# EAGLE design powerdist-hw (EAGLE 7.3.0)
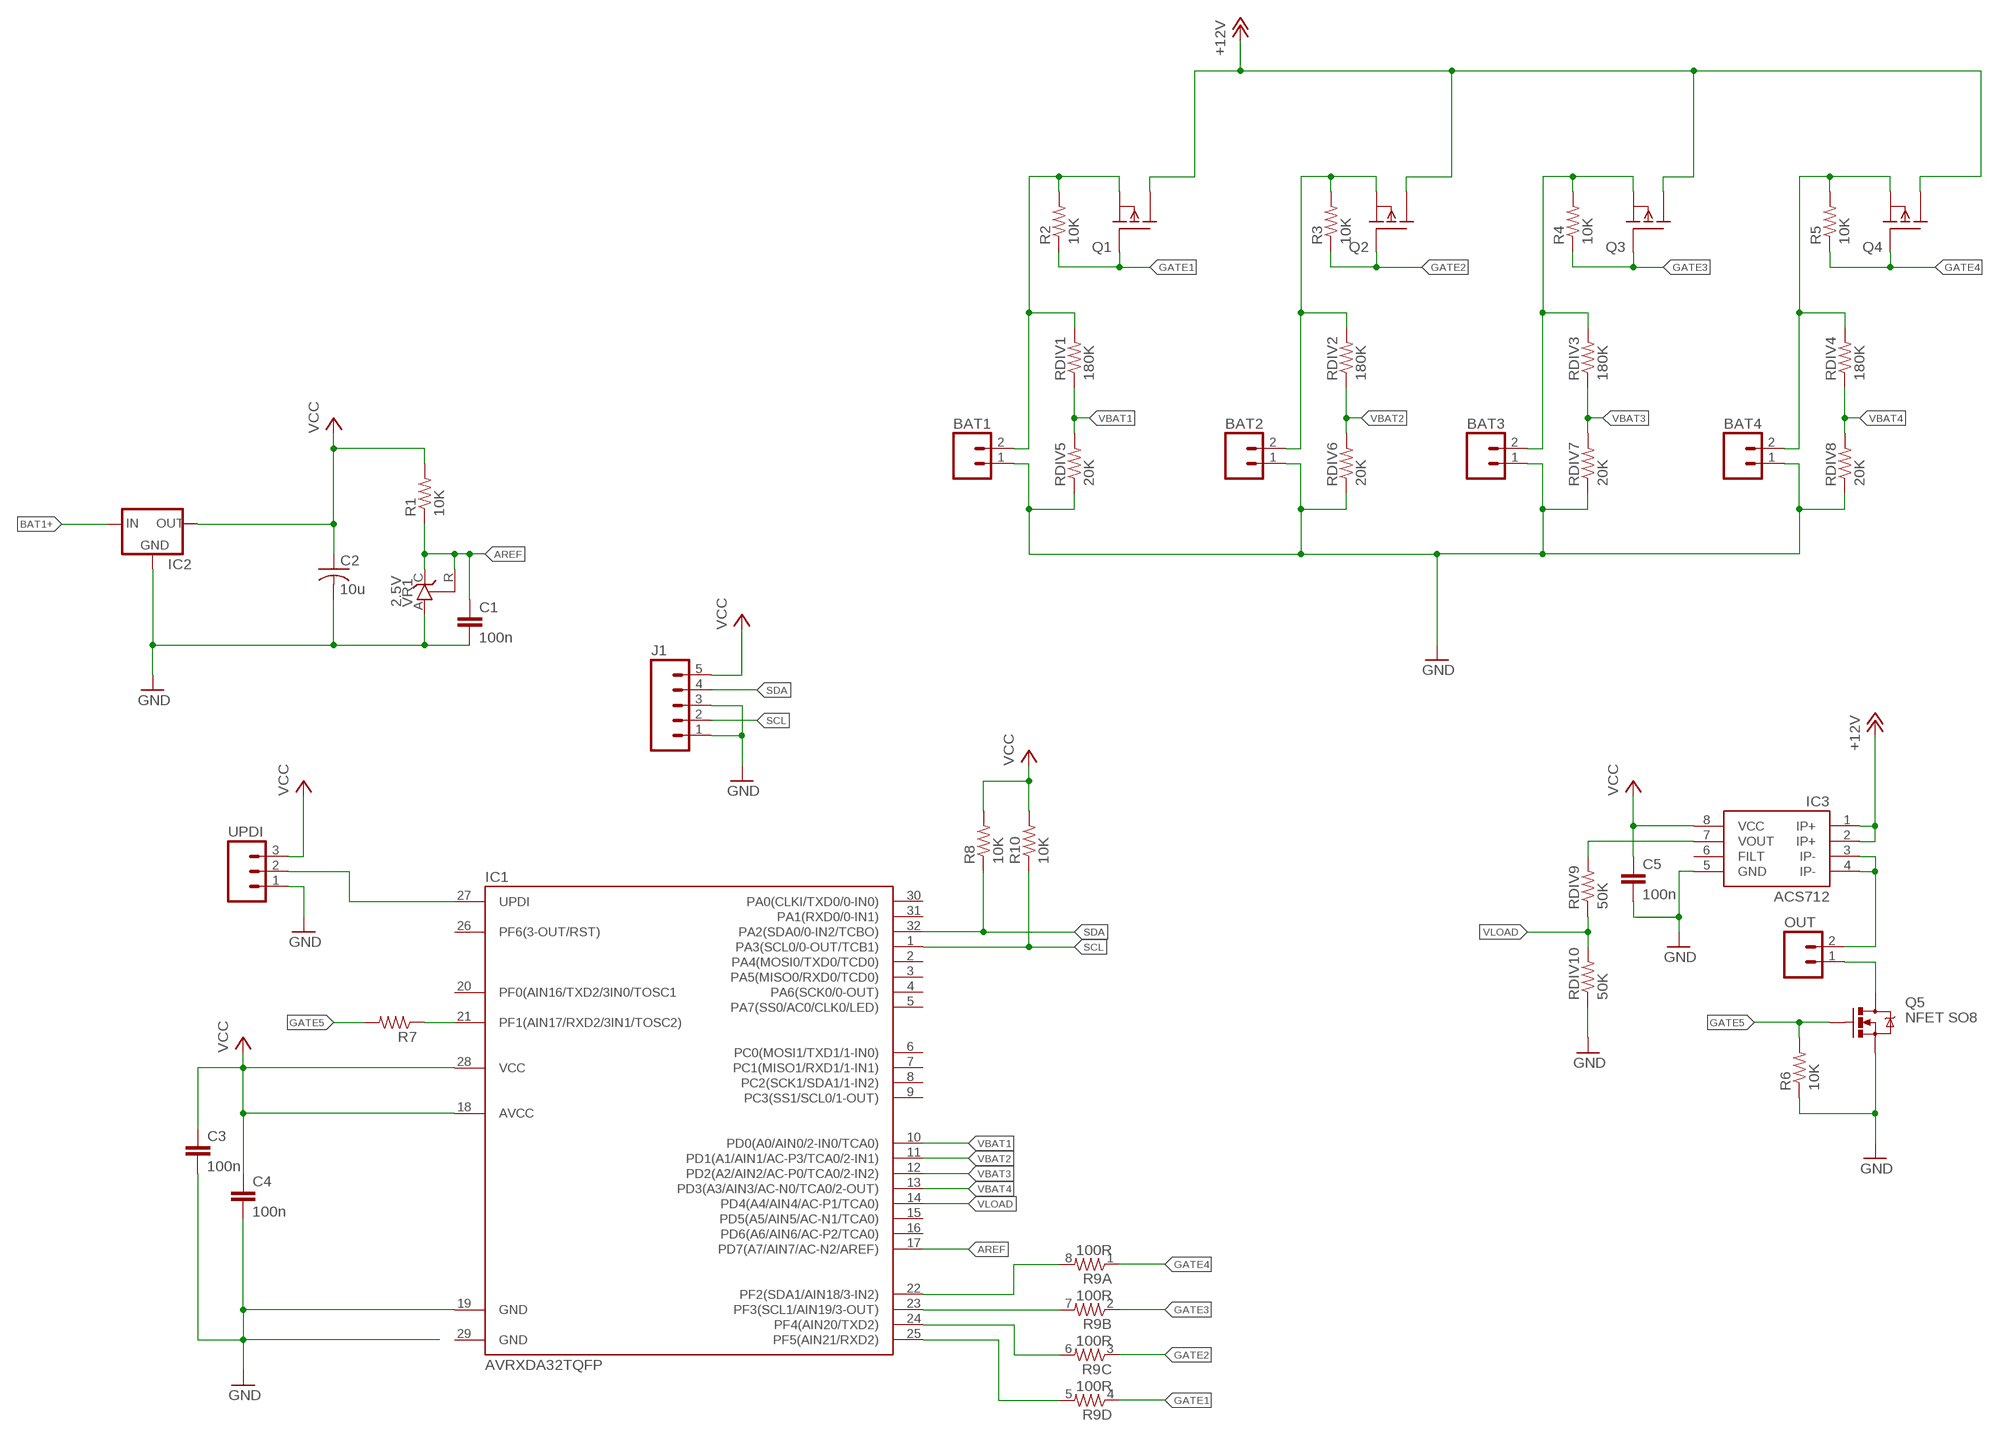
[diagram p0: schematic, sheet 1]

## Parts
BAT1  M02LOCK_LONGPADS  [1X02_LOCK_LONGPADS]
BAT2  M02LOCK_LONGPADS  [1X02_LOCK_LONGPADS]
BAT3  M02LOCK_LONGPADS  [1X02_LOCK_LONGPADS]
BAT4  M02LOCK_LONGPADS  [1X02_LOCK_LONGPADS]
C1  100n  C-EUC0603  [C0603]
C2  10u  C-USC0805  [C0805]
C3  100n  C-EUC0603  [C0603]
C4  100n  C-EUC0603  [C0603]
C5  100n  C-EUC0603  [C0603]
IC1  AVRXDA32TQFP  [TQFP32-08]
IC2  78XXS  [78XXS]
IC3  ACS712  [SO08]
J1  M05JST  [JST-5-PTH]
OUT  M02LOCK_LONGPADS  [1X02_LOCK_LONGPADS]
Q1  PFETSO8  [SO-08]
Q2  PFETSO8  [SO-08]
Q3  PFETSO8  [SO-08]
Q4  PFETSO8  [SO-08]
Q5  NFET SO8  MOSFET-NCHANNELFDS6630A  [SO08]
R1  10K  R-US_R0603  [R0603]
R2  10K  R-US_R0603  [R0603]
R3  10K  R-US_R0603  [R0603]
R4  10K  R-US_R0603  [R0603]
R5  10K  R-US_R0603  [R0603]
R6  10K  R-US_R0603  [R0603]
R7  R-US_R0603  [R0603]
R8  10K  R-US_R0603  [R0603]
R9  100R  RESISTOR-ARRAY0603-ARV  [0603-ARV]
R10  10K  R-US_R0603  [R0603]
RDIV1  180K  RESISTOR0805-RES  [0805]
RDIV2  180K  RESISTOR0805-RES  [0805]
RDIV3  180K  RESISTOR0805-RES  [0805]
RDIV4  180K  RESISTOR0805-RES  [0805]
RDIV5  20K  RESISTOR0805-RES  [0805]
RDIV6  20K  RESISTOR0805-RES  [0805]
RDIV7  20K  RESISTOR0805-RES  [0805]
RDIV8  20K  RESISTOR0805-RES  [0805]
RDIV9  50K  RESISTOR0805-RES  [0805]
RDIV10  50K  RESISTOR0805-RES  [0805]
UPDI  M03PTH  [1X03]
VR1  2.5V  TL431CLP  [TO92-CLP]

## Nets
+12V: IC3.1(IP+) IC3.2(IP+) Q1.5(D) Q1.6(D) Q1.7(D) Q1.8(D) Q2.5(D) Q2.6(D) Q2.7(D) Q2.8(D) Q3.5(D) Q3.6(D) Q3.7(D) Q3.8(D) Q4.5(D) Q4.6(D) Q4.7(D) Q4.8(D)
AREF: C1.1 IC1.17(PD7(A7/AIN7/AC-N2/AREF)) R1.1 VR1.C VR1.R
BAT1+: BAT1.2 IC2.IN Q1.1(S) Q1.2(S) Q1.3(S) R2.2 RDIV1.2
BAT2+: BAT2.2 Q2.1(S) Q2.2(S) Q2.3(S) R3.2 RDIV2.2
BAT3+: BAT3.2 Q3.1(S) Q3.2(S) Q3.3(S) R4.2 RDIV3.2
BAT4+: BAT4.2 Q4.1(S) Q4.2(S) Q4.3(S) R5.2 RDIV4.2
GATE1: Q1.4(G) R2.1 R9.4
GATE1`: IC1.25(PF5(AIN21/RXD2)) R9.5
GATE2: Q2.4(G) R3.1 R9.3
GATE3: Q3.4(G) R4.1 R9.2
GATE4: Q4.4(G) R5.1 R9.1
GATE5: Q5.4(G) R6.2 R7.2
GATE5`: IC1.21(PF1(AIN17/RXD2/3IN1/TOSC2)) R7.1
GND: BAT1.1 BAT2.1 BAT3.1 BAT4.1 C1.2 C2.2 C3.2 C4.2 C5.2 IC1.19(GND) IC2.GND IC3.5(GND) J1.1 J1.3 Q5.1(S) Q5.2(S) Q5.3(S) R6.1 RDIV5.1 RDIV6.1 RDIV7.1 RDIV8.1 RDIV10.1 UPDI.1 VR1.A
N$1: IC3.7(VOUT) RDIV9.2
N$2: IC1.27(UPDI) UPDI.2
N$3: IC1.22(PF2(SDA1/AIN18/3-IN2)) R9.8
N$4: IC1.23(PF3(SCL1/AIN19/3-OUT)) R9.7
N$5: IC1.24(PF4(AIN20/TXD2)) R9.6
OUT+: IC3.3(IP-) IC3.4(IP-) OUT.2
OUT-: OUT.1 Q5.5(D) Q5.6(D) Q5.7(D) Q5.8(D)
SCL: IC1.1(PA3(SCL0/0-OUT/TCB1)) J1.2 R10.1
SDA: IC1.32(PA2(SDA0/0-IN2/TCBO)) J1.4 R8.1
VBAT1: IC1.10(PD0(A0/AIN0/2-IN0/TCA0)) RDIV1.1 RDIV5.2
VBAT2: IC1.11(PD1(A1/AIN1/AC-P3/TCA0/2-IN1)) RDIV2.1 RDIV6.2
VBAT3: IC1.12(PD2(A2/AIN2/AC-P0/TCA0/2-IN2)) RDIV3.1 RDIV7.2
VBAT4: IC1.13(PD3(A3/AIN3/AC-N0/TCA0/2-OUT)) RDIV4.1 RDIV8.2
VCC: C2.1 C3.1 C4.1 C5.1 IC1.18(AVCC) IC1.28(VCC) IC2.OUT IC3.8(VCC) J1.5 R1.2 R8.2 R10.2 UPDI.3
VLOAD: IC1.14(PD4(A4/AIN4/AC-P1/TCA0)) RDIV9.1 RDIV10.2
Unconnected: IC1.2(PA4(MOSI0/TXD0/TCD0)) IC1.3(PA5(MISO0/RXD0/TCD0)) IC1.4(PA6(SCK0/0-OUT)) IC1.5(PA7(SS0/AC0/CLK0/LED)) IC1.6(PC0(MOSI1/TXD1/1-IN0)) IC1.7(PC1(MISO1/RXD1/1-IN1)) IC1.8(PC2(SCK1/SDA1/1-IN2)) IC1.9(PC3(SS1/SCL0/1-OUT)) IC1.15(PD5(A5/AIN5/AC-N1/TCA0)) IC1.16(PD6(A6/AIN6/AC-P2/TCA0)) IC1.20(PF0(AIN16/TXD2/3IN0/TOSC1) IC1.26(PF6(3-OUT/RST)) IC1.30(PA0(CLKI/TXD0/0-IN0)) IC1.31(PA1(RXD0/0-IN1)) IC3.6(FILT)

## Power pins joined to a net without a drawn wire
GND: IC1.29(GND)

## Library data of the parts
BAT1-BAT4 OUT = SparkFun-Connectors:M02: Standard 2-pin 0.1" header. Use with - straight break away headers ( PRT-00116) - right angle break away headers (PRT-00553) - swiss pins (PRT-00743) - machine pins (PRT-00117) - female headers (PRT-00115) Molex polarized connector foot print use with: PRT-08233 with associated crimp pins and housings. 2.54_SCREWTERM for use with PRT-10571. 3.5mm Screw Terminal footprints for PRT-08084 5mm Screw Terminal footprints for use with PRT-08432
C1 C3-C5 = rcl:C-EU: CAPACITOR, European symbol
C2 = rcl:C-US: CAPACITOR, American symbol
IC1 = microchip-special:AVRXDA32: The AVR128DA28/32/48/64 microcontrollers of the AVR® DA family are using the AVR CPU with hardware multiplier, running at up to 24 MHz, with 128 KB of Flash, 16 KB of SRAM, and 512B of EEPROM in 28-, 32-, 48- or 64-pin packages. The AVR® DA family uses the latest technologies from Microchip Technology, with a flexible and low-power architecture including Event System, intelligent analog features, advanced digital peripherals and Peripheral Touch Controller (PTC).
IC2 = v-reg:78XXS: VOLTAGE REGULATOR
IC3 = SparkFun-AnalogIC:ACS712: Hall-effect-based isolated linear current sensor; PROD_ID: IC-08964
J1 = SparkFun-Connectors:M05: Header 5 Standard 5-pin 0.1" header. Use with straight break away headers (SKU : PRT-00116), right angle break away headers (PRT-00553), swiss pins (PRT-00743), machine pins (PRT-00117), and female headers (PRT-00115). Molex polarized connector foot print use with SKU : PRT-08230 with associated crimp pins and housings.
Q1-Q4 = transistor-generic:PFET
Q5 = SparkFun-DiscreteSemi:MOSFET-NCHANNEL: Common NMOSFET Parts MFG P/N Store ID Prod ID FDD8780 TRANS-09984 SI7820DN TRANS-11055 FDS6630A IC-08089 2N7002PW TRANS-11151 FQP30N06L COM-10213 TRANS-10060 BSS123LT1G TRANS-08345 BSS138 TRANS-00830 BS170 2N7000; PROD_ID: IC-08089
R1-R8 R10 = rcl:R-US_: RESISTOR, American symbol
R9 = SparkFun-Resistors:RESISTOR-ARRAY: Array Chip Resistor Source: RS Component / Phycomp
RDIV1-RDIV10 = SparkFun-Resistors:RESISTOR: Resistor Basic schematic elements and footprints for 0603, 1206, and PTH resistors.
UPDI = SparkFun-Connectors:M03: Header 3 Standard 3-pin 0.1" header. Use with straight break away headers (SKU : PRT-00116), right angle break away headers (PRT-00553), swiss pins (PRT-00743), machine pins (PRT-00117), and female headers (PRT-00115). Molex polarized connector foot print use with SKU : PRT-08232 with associated crimp pins and housings.
VR1 = vreg-special:TL431CLP: VOLTAGE REGULATOR

## Board
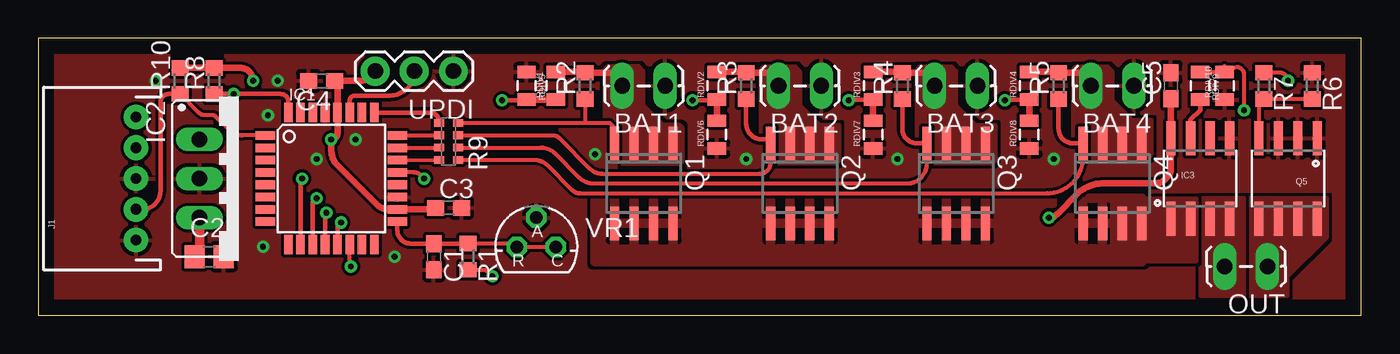
[diagram p1: board, top side]
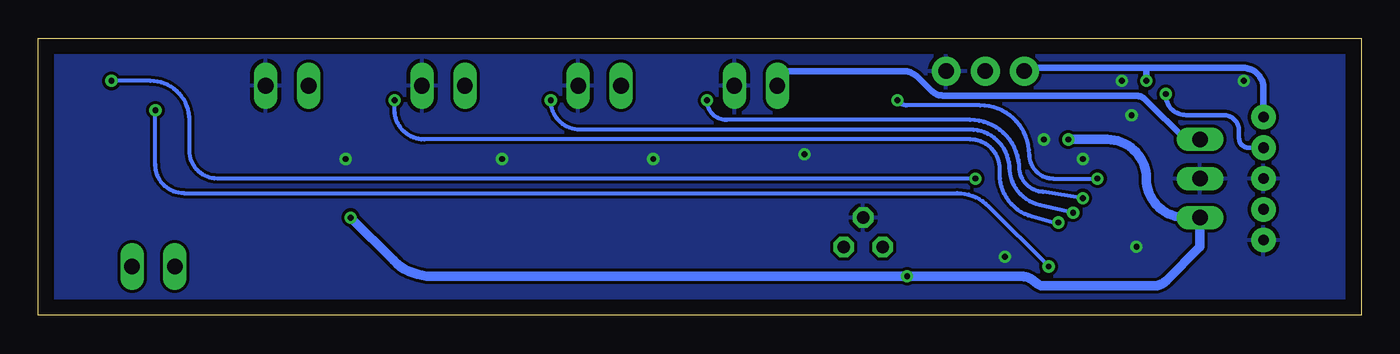
[diagram p2: board, bottom side, seen from below]

Size 86.03 x 18 mm. Coordinates in mm from the lower left corner, seen from the top.
Outline: 0,0 86.03,0 86.03,18 0,18 0,0
Copper layers (1*16): Top 0.035mm / dielectric 1.5mm / Bottom 0.035mm
Design rules "default": minimum track width 10mil, minimum drill 24mil, track to track 8mil, track to pad 8mil, pad to pad 8mil, via to via 8mil, smd to smd 8mil, copper to edge 40mil, drill to drill 8mil, minimum pad ring 10mil, minimum via ring 8mil, stop-mask expansion 4mil, vias tented up to drill 0mil, thermal gap 10mil

### Footprints (pad centres in the part's own frame; a part is rotated, then mirrored left to right if it is on the bottom)
1X02_LOCK_LONGPADS = drill 1.016 long: 1 -0.127,0; 2 2.667,0
C0603 = smd 1.1 x 1: 1 -0.85,0; 2 0.85,0
C0805 = smd 1.3 x 1.5: 1 -0.95,0; 2 0.95,0
TQFP32-08 = smd 1.27 x 0.559: 1 -4.293,2.8; 2 -4.293,2; 3 -4.293,1.2; 4 -4.293,0.4; 5 -4.293,-0.4; 6 -4.293,-1.2; 7 -4.293,-2; 8 -4.293,-2.8; 17 4.293,-2.8; 18 4.293,-2; 19 4.293,-1.2; 20 4.293,-0.4; 21 4.293,0.4; 22 4.293,1.2; 23 4.293,2; 24 4.293,2.8 | smd 0.559 x 1.27: 9 -2.8,-4.293; 10 -2,-4.293; 11 -1.2,-4.293; 12 -0.4,-4.293; 13 0.4,-4.293; 14 1.2,-4.293; 15 2,-4.293; 16 2.8,-4.293; 25 2.8,4.293; 26 2,4.293; 27 1.2,4.293; 28 0.4,4.293; 29 -0.4,4.293; 30 -1.2,4.293; 31 -2,4.293; 32 -2.8,4.293
78XXS = drill 1.016 long: GND 0,-2.54; IN -2.54,-2.54; OUT 2.54,-2.54
SO08 = smd 0.61 x 2.21: 1 -1.905,-2.616; 2 -0.635,-2.616; 3 0.635,-2.616; 4 1.905,-2.616; 5 1.905,2.616; 6 0.635,2.616; 7 -0.635,2.616; 8 -1.905,2.616
JST-5-PTH = drill 0.7 pad 1.6: 1 -4,0; 2 -2,0; 3 0,0; 4 2,0; 5 4,0
SO-08 = smd 0.6 x 2.2: 1 -1.905,-2.6; 2 -0.635,-2.6; 3 0.635,-2.6; 4 1.905,-2.6; 5 1.905,2.6; 6 0.635,2.6; 7 -0.635,2.6; 8 -1.905,2.6
R0603 = smd 1 x 1.1: 1 -0.85,0; 2 0.85,0
0603-ARV = smd 0.5 x 0.65: 1 -1.2,-0.625; 2 -0.4,-0.625; 3 0.4,-0.625; 4 1.2,-0.625; 5 1.2,0.625; 6 0.4,0.625; 7 -0.4,0.625; 8 -1.2,0.625
0805 = smd 0.8 x 1.2: 1 -0.9,0; 2 0.9,0
1X03 = drill 1.016 pad 1.88: 1 0,0; 2 2.54,0; 3 5.08,0
TO92-CLP = drill 0.813 octagon: A 0,1.905; C 1.27,0; R -1.27,0

### Placement (x,y rotation side)
BAT1  40.64,14.92 180 top
BAT2  50.8,14.92 180 top
BAT3  60.96,14.92 180 top
BAT4  71.12,14.92 180 top
C1  25.72,3.81 270 top
C2  11.11,3.81 0 top
C3  26.67,6.99 0 top
C4  18.41,15.24 180 top
C5  73.66,14.92 90 top
IC1  19.05,8.89 0 top
IC2  13.02,8.89 270 top
IC3  75.56,8.89 0 top
J1  6.35,8.89 90 top
OUT  79.82,3.17 180 top
Q1  39.37,8.57 180 top
Q2  49.53,8.57 180 top
Q3  59.69,8.57 180 top
Q4  69.85,8.57 180 top
Q5  81.28,8.89 180 top
R1  27.94,3.81 270 top
R2  35.56,14.92 90 top
R3  46.04,14.92 90 top
R4  56.2,14.92 90 top
R5  66.36,14.92 90 top
R6  82.87,14.92 270 top
R7  79.69,14.92 270 top
R8  11.43,15.24 90 top
R9  26.67,11.3 90 top
R10  9.21,15.24 90 top
RDIV1  33.66,14.92 90 top
RDIV2  44.13,14.92 90 top
RDIV3  54.29,14.92 90 top
RDIV4  64.45,14.92 90 top
RDIV5  31.75,14.92 270 top
RDIV6  44.13,11.75 90 top
RDIV7  54.29,11.75 90 top
RDIV8  64.45,11.75 90 top
RDIV9  75.56,14.92 270 top
RDIV10  77.15,14.92 90 top
UPDI  26.99,15.88 180 top
VR1  32.38,4.45 0 top

### Tracks (layer width: path | path; a pad name or v marks a point on that pad's centre or on a via)
+12V
  pour Top (rank 4): 36.2,7.62 71.75,7.62 71.75,3.49 36.2,3.49
  pour Top (rank 3, no thermals): 69.85,7.62 75.31,7.62 75.31,3.49 69.85,3.49
AREF
  Top 0.254: VR1.C VR1.R 31.11,4.66 R1.1
  Top 0.305: R1.1 C1.1 24.23,4.66 arc-90 23.34,5.55 IC1.17
BAT1+
  Top 0.406: 37.97,15.82 BAT1.2 37.97,15.77 R2.2 35.56,15.82 RDIV1.2
  Bottom 0.406: IC2.IN 11.43,11.43 13.99,13.99 arc-45 14.7,14.29 27.21,14.29 arc45 27.92,14.58 28.79,15.46 arc-45 29.8,15.88 37.97,15.88 BAT1.2
  pour Top (rank 4, no thermals): 39.05,16.19 37.15,16.19 arc90 36.83,15.88 36.83,10.16 arc90 37.15,9.84 41.59,9.84 arc90 41.91,10.16 41.91,12.06 arc90 41.59,12.38 40.64,12.38 39.37,13.65 39.37,15.88
BAT2+
  Top 0.406: RDIV2.2 46.04,15.82 R3.2 48.13,15.77 BAT2.2
  pour Top (rank 4, no thermals): 52.07,12.38 52.07,10.16 arc-90 51.75,9.84 47.31,9.84 arc-90 46.99,10.16 46.99,15.88 arc-90 47.31,16.19 49.21,16.19 49.53,15.88 49.53,13.65 50.8,12.38
BAT3+
  Top 0.406: RDIV3.2 56.2,15.82 R4.2 58.29,15.77 BAT3.2
  pour Top (rank 4, no thermals): 62.23,12.38 62.23,10.16 arc-90 61.91,9.84 57.47,9.84 arc-90 57.15,10.16 57.15,15.88 arc-90 57.47,16.19 59.37,16.19 59.69,15.88 59.69,13.65 60.96,12.38
BAT4+
  Top 0.406: RDIV4.2 66.36,15.82 R5.2 68.45,15.77 BAT4.2
  pour Top (rank 4, no thermals): 71.94,10.16 67.63,10.16 arc-90 67.31,10.48 67.31,15.88 arc-90 67.63,16.19 69.53,16.19 69.85,15.88 69.85,13.97 71.12,12.7 72.39,12.7 72.39,10.61 arc-90
GATE1
  Top 0.254: R9.4 35.56,12.5 | Q1.4 37.47,12.19 37.15,12.5 35.56,12.5 | R2.1 35.56,12.5
GATE1`
  Top 0.305: IC1.25 25.48,13.18 arc-90 26.04,12.63 R9.5
GATE2
  Top 0.254: R9.3 33.43,11.7 arc-45 33.89,11.51 35.86,9.54 arc45 36.67,9.21 46.91,9.21 arc90 47.62,9.92 Q2.4
  Top 0.305: 47.62,10.11 Q2.4 47.62,11.43 47.04,11.43 arc-90 46.04,12.43 R3.1
GATE3
  Top 0.254: R9.2 32.69,10.9 arc-45 33.61,10.52 35.18,8.96 arc45 36.1,8.57 56.52,8.57 arc90 57.78,9.84 Q3.4
  Top 0.305: Q3.4 57.15,11.17 arc-90 56.2,12.13 R4.1
GATE4
  Top 0.254: R9.1 32.25,10.1 arc-45 33.12,9.74 34.72,8.14 arc45 35.22,7.94 65.62,7.94 arc90 67.94,10.26
  Top 0.305: R5.1 66.36,12.13 arc90 67.31,11.17 Q4.4 67.94,10.26
GATE5
  Top 0.254: Q5.4 79.38,14.07 R7.2 R6.2
GATE5`  (via drill 0.38)
  Top 0.254: v25.08,8.89 24.99,9.01 arc52 24.4,9.29 IC1.21 | v81.28,15.24 arc90 80.75,15.77 R7.1
  Bottom 0.254: v25.08,8.89 74.4,8.89 arc90 76.2,10.69 76.2,12.7 arc-90 78.74,15.24 v81.28,15.24
GND  (via drill 0.38)
  other vias: 14.92,13.02 15.56,15.24 20.64,11.43 18.1,10.16 7.62,15.24 23.18,3.81 14.61,4.45 36.2,10.48 46.04,10.16 55.88,10.16 66.04,10.16
  pour Top (rank 6): 0,17.78 86.36,17.78 86.36,0 0,0
  pour Bottom (rank 6): 86.36,17.78 0,17.78 0,0 86.36,0
N$1
  Top 0.305: RDIV9.2 75.56,13.34 74.93,12.7 IC3.7
N$2
  Top 0.305: IC1.27 20.25,13.96 arc-90 20.57,14.29 22.86,14.29 arc90 UPDI.2
N$3
  Top 0.254: IC1.22 R9.8
N$4
  Top 0.254: IC1.23 R9.7
N$5
  Top 0.254: IC1.24 R9.6
OUT+
  pour Top (rank 4, no thermals): 75.56,7.62 75.56,1.27 78.42,1.27 78.42,7.62
OUT-
  pour Top (rank 5, no thermals): 78.74,7.62 78.74,1.27 81.28,1.27 81.28,2.54 83.82,5.08 83.82,7.62
SCL
  Top 0.254: IC1.1 13.27,11.69 arc-45 12.39,12.05 11.52,12.93 arc45 11.3,13.02 10.8,13.02 arc-45 10.43,13.17 R10.1
  Top 0.305: J1.2 6.74,6.89 arc90 7.94,8.09 7.94,13.86 arc-90 8.46,14.39 R10.1
SDA  (via drill 0.38)
  Top 0.305: 16.25,13.02 IC1.32 16.25,13.9 arc90 15.76,14.39 13.97,14.39 v12.7,14.39 R8.1
  Bottom 0.305: J1.4 7.31,10.89 arc90 7.94,11.52 7.94,12.01 arc-90 8.94,13.02 11.39,13.02 arc90 12.7,14.33 v12.7,14.39
VBAT1  (via drill 0.38)
  Top 0.305: RDIV5.2 31.75,13.97 v30.16,13.97 | v17.14,8.89 arc90 17.05,8.79 IC1.10
  Top 0.406: RDIV5.2 RDIV1.1
  Bottom 0.254: v17.14,8.89 20.02,8.89 arc90 21.59,10.46 arc-90 24.78,13.65 29.55,13.65 arc45 30.05,13.86 v30.16,13.97
VBAT2  (via drill 0.38)
  Top 0.305: 17.78,4.6 IC1.11 17.85,7.37 arc-90 v18.1,7.62 | v42.55,13.97 44.13,13.97 RDIV2.1
  Top 0.406: RDIV6.2 RDIV2.1
  Bottom 0.254: v18.1,7.62 20.67,8.02 arc81 22.23,9.51 arc-90 25.42,12.7 41.27,12.7 arc90 v42.55,13.97
VBAT3  (via drill 0.38)
  Top 0.305: v52.7,13.97 52.7,14.02 RDIV3.1 | IC1.12 18.65,6.67 v18.73,6.67
  Top 0.406: RDIV3.1 RDIV7.2
  Bottom 0.254: v18.73,6.67 20.89,7.17 arc77 22.86,9.64 22.86,9.51 arc-90 25.42,12.06 50.8,12.06 arc90 v52.7,13.97
VBAT4  (via drill 0.38)
  Top 0.305: IC1.13 19.45,5.8 arc-90 v19.68,6.03 | v62.87,13.97 62.87,14.02 RDIV4.1
  Top 0.406: RDIV8.2 RDIV4.1
  Bottom 0.254: v19.68,6.03 20,6.03 21.39,6.41 arc75 23.5,9.17 23.5,9.5 arc-90 25.43,11.43 60.93,11.43 arc90 62.87,13.36 v62.87,13.97
VCC  (via drill 0.38)
  Top 0.254: IC1.18 23.34,6.99 | R1.2 28.93,2.96 arc-45 29.23,2.83 v29.53,2.54
  Top 0.406: C5.1 IC3.8 73.66,9.5 arc-45 73.45,9 73.3,8.85 arc-45 72.63,8.57 69.18,8.57 arc45 67.61,7.92 66.27,6.58 arc-45 v65.72,6.35 | 19.45,15.24 IC1.28 19.45,11.83 arc-90 v19.05,11.43 19.05,10.69 arc45 19.42,9.79 22.02,7.19 arc45 22.75,6.89 IC1.18 25.73,6.89 C3.1 | 19.45,15.24 C4.1 | R10.2 R8.2 13.12,16.09 arc-90 v13.97,15.24 | 19.45,15.24 20.88,15.24 arc45 21.55,15.52 UPDI.3
  Top 0.61: C2.1 10.48,3.81 IC2.OUT
  Bottom 0.406: J1.5 6.35,14.75 arc-90 7.69,16.09 13.97,16.09 | v13.97,15.24 13.97,16.09 | 13.97,16.09 21.69,16.09 UPDI.3
  Bottom 0.61: v19.05,11.43 16.51,11.43 arc90 13.97,8.89 arc-90 11.43,6.35 IC2.OUT 10.48,4.45 12.68,2.24 arc45 13.49,1.91 20.58,1.91 arc45 21.22,2.17 arc-45 22.12,2.54 v29.53,2.54 60.47,2.54 arc45 62.94,3.56 v65.72,6.35
VLOAD  (via drill 0.38)
  Top 0.254: RDIV9.1 RDIV10.2 | RDIV10.2 77.15,16.19 | v78.42,13.34 78.42,15.65 arc90 77.94,16.14 RDIV10.2 | v20.32,3.17 20.25,3.17 IC1.14
  Bottom 0.254: v20.32,3.17 24.24,7.09 arc-45 26.27,7.94 76.57,7.94 arc90 78.42,9.79 v78.42,13.34